# EAGLE schematic Power_Cape (EAGLE 7.7.0)
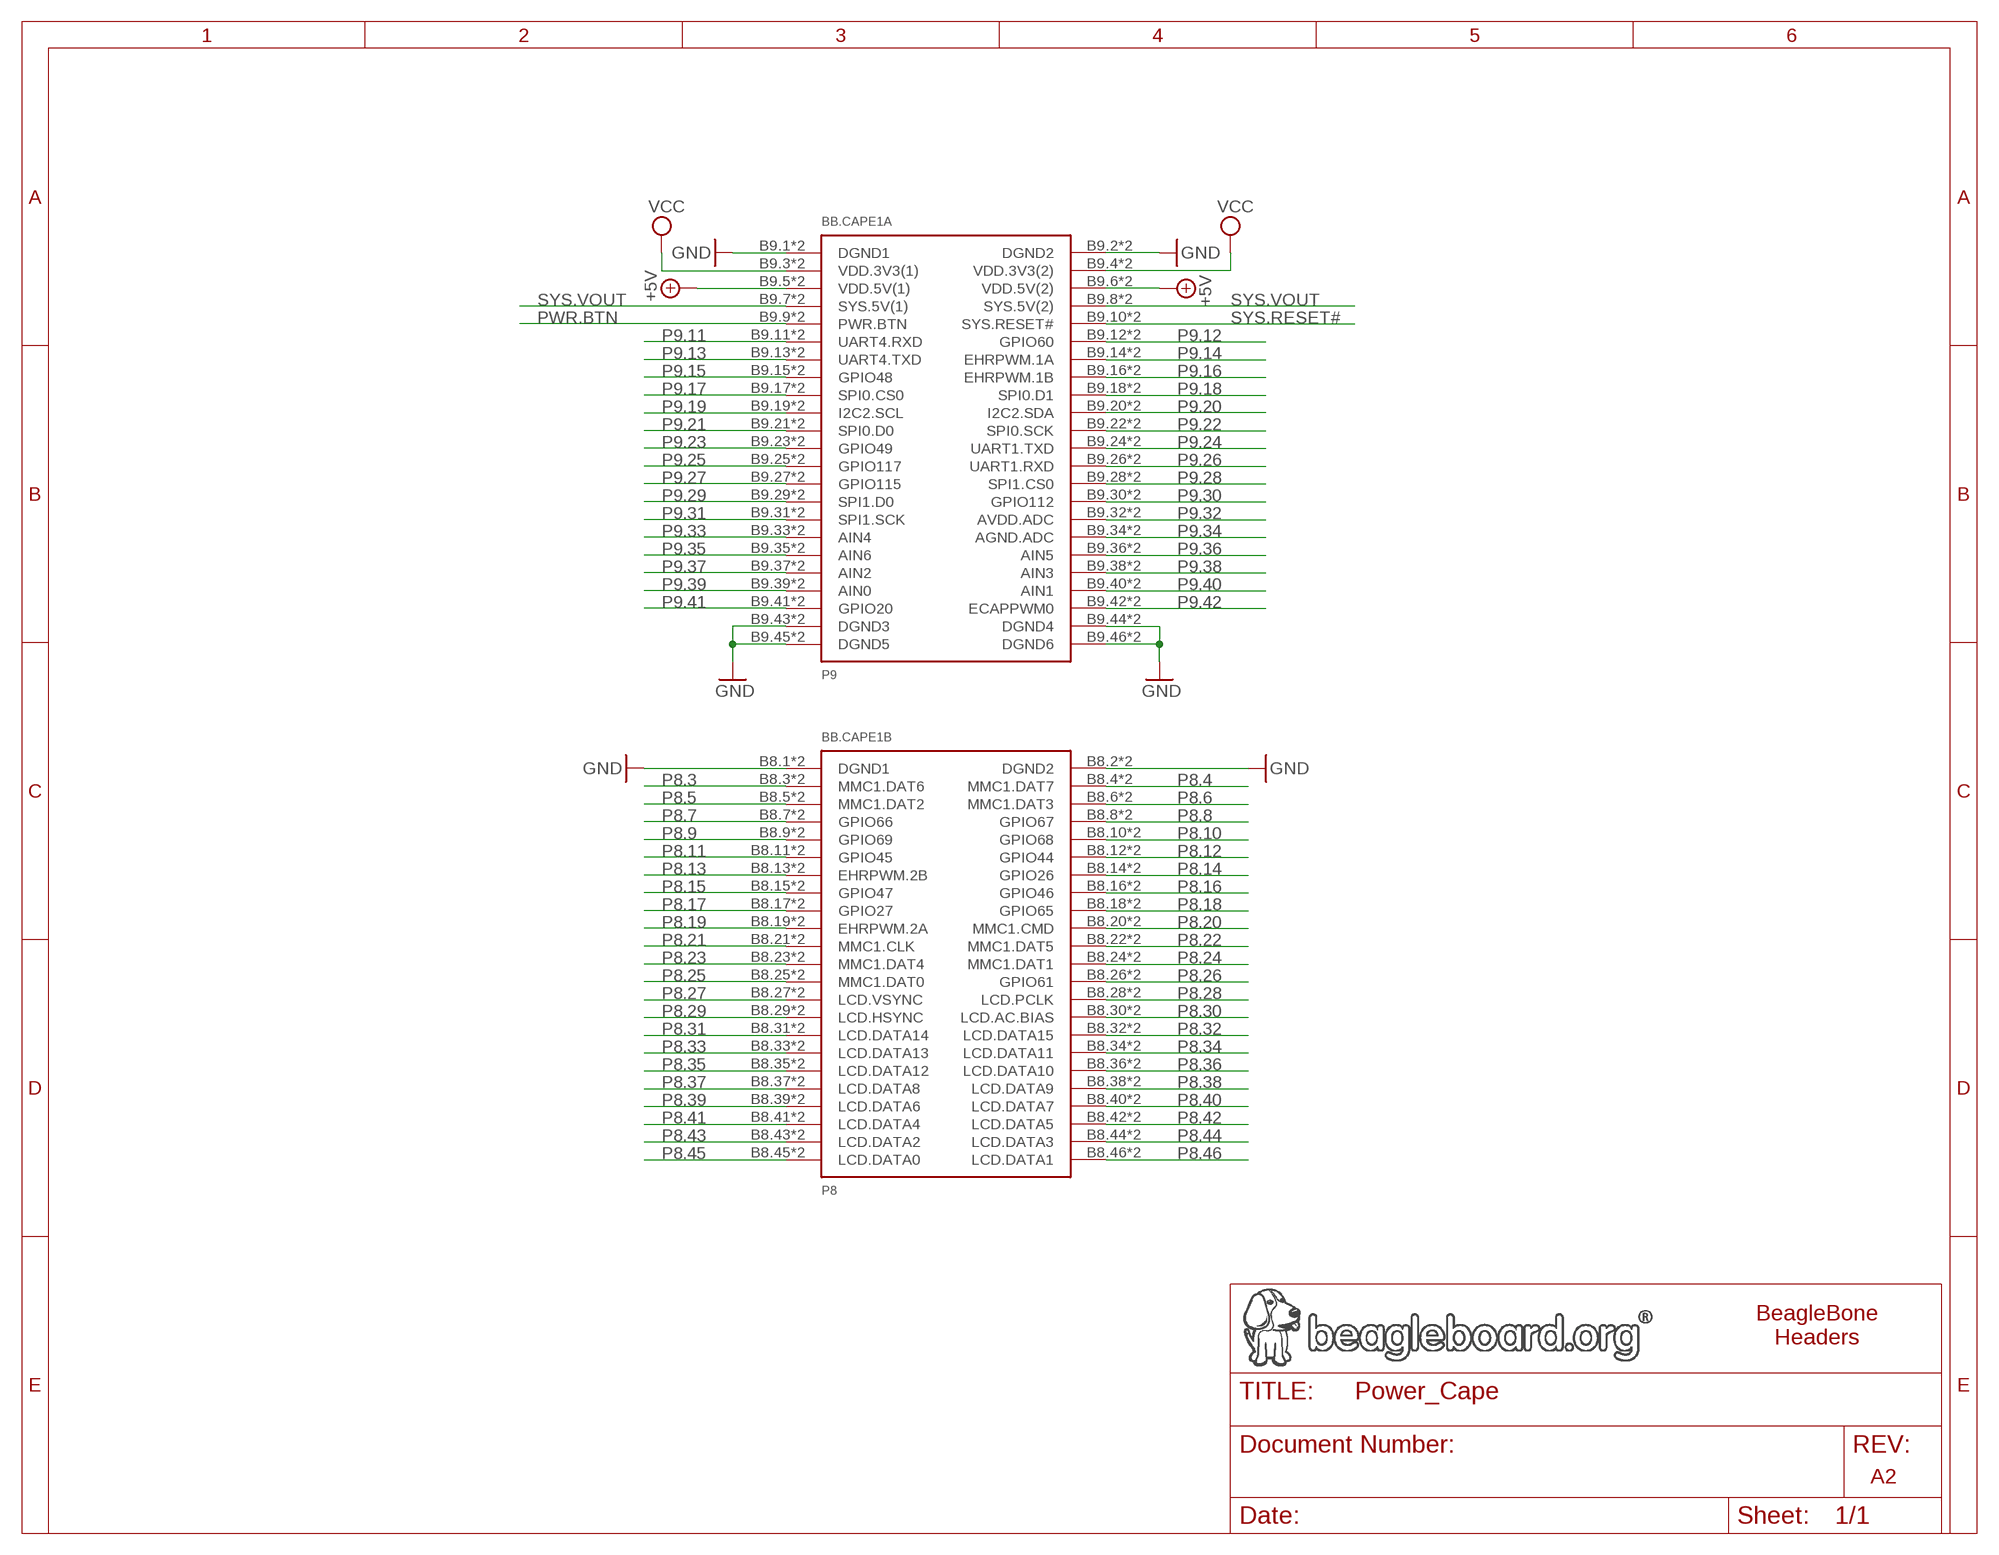
[diagram p0: schematic, sheet 1, part 1 of 2]
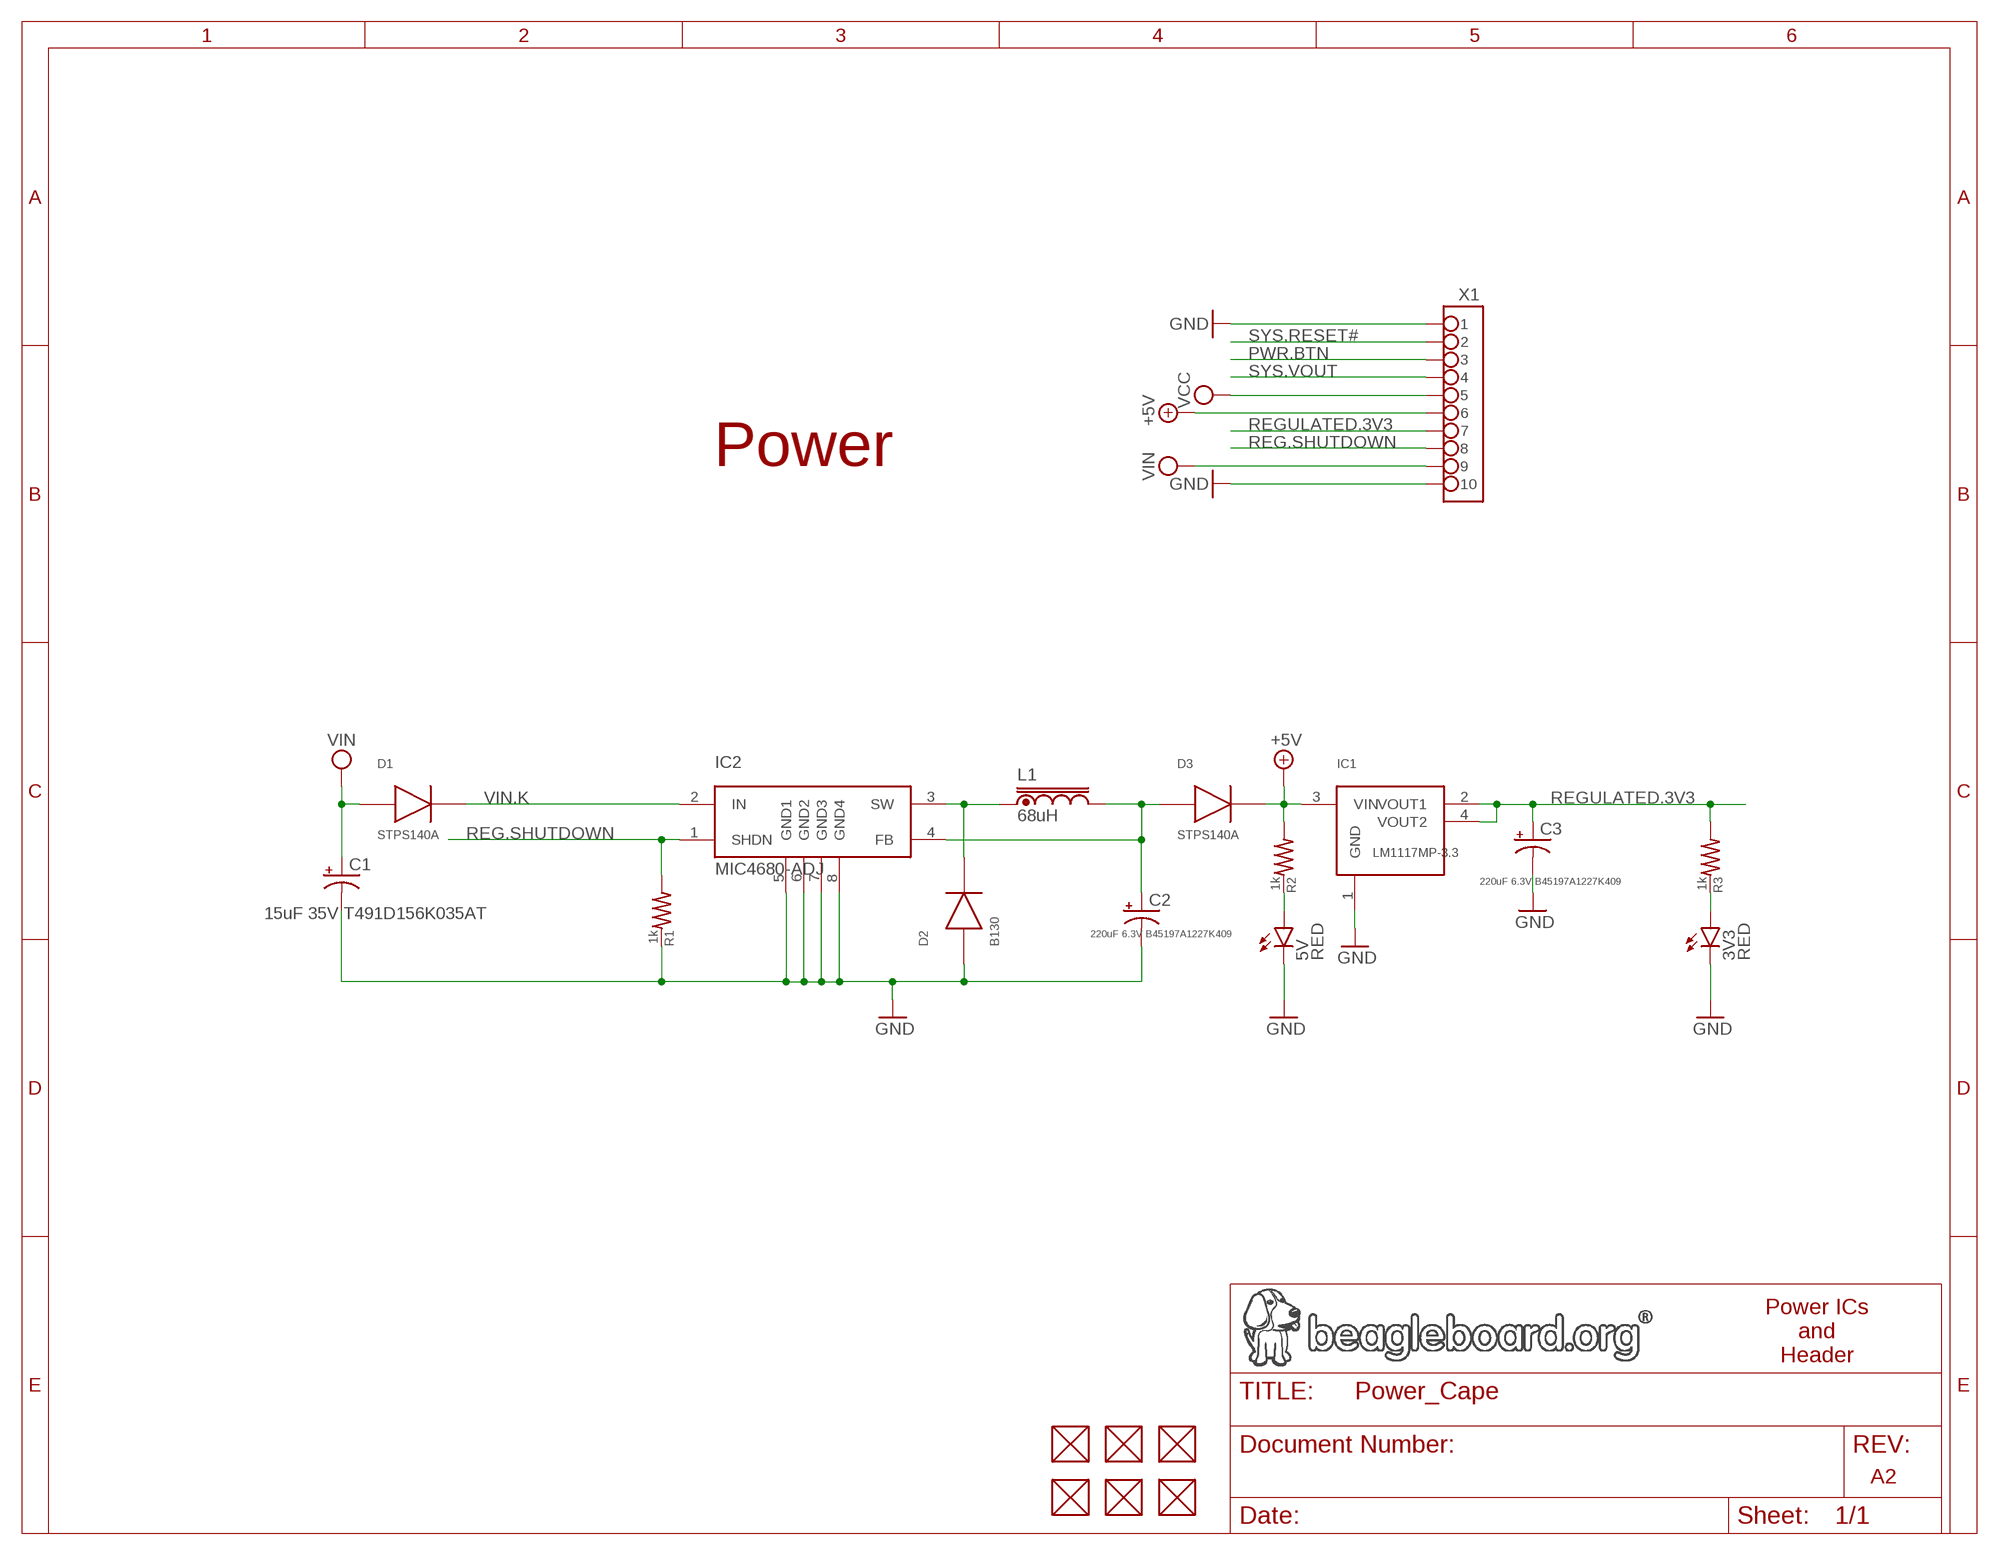
[diagram p1: schematic, sheet 1, part 2 of 2]

## Parts
3V3  RED  LED-(INCH)-0805  [0805-LED]
5V  RED  LED-(INCH)-0805  [0805-LED]
BB.CAPE1  BEAGLEBONE.CAPE.TOP/BOTTOM-PADS  [BEAGLEBONE.CAPE.TOP/BOTTOM-PADS]
C1  15uF 35V T491D156K035AT  CPOL-USD/7343-31W  [D/7343-31W]
C2  220uF 6.3V B45197A1227K409  CPOL-USD/7343-31W  [D/7343-31W]
C3  220uF 6.3V B45197A1227K409  CPOL-USD/7343-31W  [D/7343-31W]
D1  STPS140A  DIODE_SMA  [DIODE_SMA]
D2  B130  DIODE_SMA  [DIODE_SMA]
D3  STPS140A  DIODE_SMA  [DIODE_SMA]
FUD1  FIDUCIAL  [FIDUCIAL_40MIL]
FUD2  FIDUCIAL  [FIDUCIAL_40MIL]
FUD3  FIDUCIAL  [FIDUCIAL_40MIL]
FUD4  FIDUCIAL  [FIDUCIAL_40MIL]
FUD5  FIDUCIAL  [FIDUCIAL_40MIL]
FUD6  FIDUCIAL  [FIDUCIAL_40MIL]
IC1  LM1117MP-3.3  LM1117  [SOT223]
IC2  MIC4680-ADJ  MIC4680  [SO8]
L1  68uH  UP2B-XXX  [UP2B-(UNI-PAC)]
R1  1k  RESISTOR-(INCH)-0402  [0402]
R2  1k  RESISTOR-(INCH)-0402  [0402]
R3  1k  RESISTOR-(INCH)-0402  [0402]
X1  TB-10TERM-150MIL.PITCH  [TERMINAL.BLOCK-10TERM-150MIL.PITCH]

## Nets
5VOUT.A: D2.K IC2.3(SW) L1.1
5VOUT.B: C2.+ D3.A IC2.4(FB) L1.2
+5V [power]: BB.CAPE1.B9.5(A:VDD.5V(1)) BB.CAPE1.B9.6(A:VDD.5V(2)) BB.CAPE1.T9.5(A:VDD.5V(1)) BB.CAPE1.T9.6(A:VDD.5V(2)) D3.K IC1.3(VIN) R2.1 X1.6
GND: 3V3.K 5V.K BB.CAPE1.B8.1(B:DGND1) BB.CAPE1.B8.2(B:DGND2) BB.CAPE1.B9.1(A:DGND1) BB.CAPE1.B9.2(A:DGND2) BB.CAPE1.B9.43(A:DGND3) BB.CAPE1.B9.44(A:DGND4) BB.CAPE1.B9.45(A:DGND5) BB.CAPE1.B9.46(A:DGND6) BB.CAPE1.T8.1(B:DGND1) BB.CAPE1.T8.2(B:DGND2) BB.CAPE1.T9.1(A:DGND1) BB.CAPE1.T9.2(A:DGND2) BB.CAPE1.T9.43(A:DGND3) BB.CAPE1.T9.44(A:DGND4) BB.CAPE1.T9.45(A:DGND5) BB.CAPE1.T9.46(A:DGND6) C1.- C2.- C3.- D2.A IC1.1(GND) IC2.5(GND1) IC2.6(GND2) IC2.7(GND3) IC2.8(GND4) R1.2 X1.1 X1.10
N$3: 5V.A R2.2
N$36: 3V3.A R3.2
P8.3: BB.CAPE1.B8.3(B:MMC1.DAT6) BB.CAPE1.T8.3(B:MMC1.DAT6)
P8.4: BB.CAPE1.B8.4(B:MMC1.DAT7) BB.CAPE1.T8.4(B:MMC1.DAT7)
P8.5: BB.CAPE1.B8.5(B:MMC1.DAT2) BB.CAPE1.T8.5(B:MMC1.DAT2)
P8.6: BB.CAPE1.B8.6(B:MMC1.DAT3) BB.CAPE1.T8.6(B:MMC1.DAT3)
P8.7: BB.CAPE1.B8.7(B:GPIO66) BB.CAPE1.T8.7(B:GPIO66)
P8.8: BB.CAPE1.B8.8(B:GPIO67) BB.CAPE1.T8.8(B:GPIO67)
P8.9: BB.CAPE1.B8.9(B:GPIO69) BB.CAPE1.T8.9(B:GPIO69)
P8.10: BB.CAPE1.B8.10(B:GPIO68) BB.CAPE1.T8.10(B:GPIO68)
P8.11: BB.CAPE1.B8.11(B:GPIO45) BB.CAPE1.T8.11(B:GPIO45)
P8.12: BB.CAPE1.B8.12(B:GPIO44) BB.CAPE1.T8.12(B:GPIO44)
P8.13: BB.CAPE1.B8.13(B:EHRPWM.2B) BB.CAPE1.T8.13(B:EHRPWM.2B)
P8.14: BB.CAPE1.B8.14(B:GPIO26) BB.CAPE1.T8.14(B:GPIO26)
P8.15: BB.CAPE1.B8.15(B:GPIO47) BB.CAPE1.T8.15(B:GPIO47)
P8.16: BB.CAPE1.B8.16(B:GPIO46) BB.CAPE1.T8.16(B:GPIO46)
P8.17: BB.CAPE1.B8.17(B:GPIO27) BB.CAPE1.T8.17(B:GPIO27)
P8.18: BB.CAPE1.B8.18(B:GPIO65) BB.CAPE1.T8.18(B:GPIO65)
P8.19: BB.CAPE1.B8.19(B:EHRPWM.2A) BB.CAPE1.T8.19(B:EHRPWM.2A)
P8.20: BB.CAPE1.B8.20(B:MMC1.CMD) BB.CAPE1.T8.20(B:MMC1.CMD)
P8.21: BB.CAPE1.B8.21(B:MMC1.CLK) BB.CAPE1.T8.21(B:MMC1.CLK)
P8.22: BB.CAPE1.B8.22(B:MMC1.DAT5) BB.CAPE1.T8.22(B:MMC1.DAT5)
P8.23: BB.CAPE1.B8.23(B:MMC1.DAT4) BB.CAPE1.T8.23(B:MMC1.DAT4)
P8.24: BB.CAPE1.B8.24(B:MMC1.DAT1) BB.CAPE1.T8.24(B:MMC1.DAT1)
P8.25: BB.CAPE1.B8.25(B:MMC1.DAT0) BB.CAPE1.T8.25(B:MMC1.DAT0)
P8.26: BB.CAPE1.B8.26(B:GPIO61) BB.CAPE1.T8.26(B:GPIO61)
P8.27: BB.CAPE1.B8.27(B:LCD.VSYNC) BB.CAPE1.T8.27(B:LCD.VSYNC)
P8.28: BB.CAPE1.B8.28(B:LCD.PCLK) BB.CAPE1.T8.28(B:LCD.PCLK)
P8.29: BB.CAPE1.B8.29(B:LCD.HSYNC) BB.CAPE1.T8.29(B:LCD.HSYNC)
P8.30: BB.CAPE1.B8.30(B:LCD.AC.BIAS) BB.CAPE1.T8.30(B:LCD.AC.BIAS)
P8.31: BB.CAPE1.B8.31(B:LCD.DATA14) BB.CAPE1.T8.31(B:LCD.DATA14)
P8.32: BB.CAPE1.B8.32(B:LCD.DATA15) BB.CAPE1.T8.32(B:LCD.DATA15)
P8.33: BB.CAPE1.B8.33(B:LCD.DATA13) BB.CAPE1.T8.33(B:LCD.DATA13)
P8.34: BB.CAPE1.B8.34(B:LCD.DATA11) BB.CAPE1.T8.34(B:LCD.DATA11)
P8.35: BB.CAPE1.B8.35(B:LCD.DATA12) BB.CAPE1.T8.35(B:LCD.DATA12)
P8.36: BB.CAPE1.B8.36(B:LCD.DATA10) BB.CAPE1.T8.36(B:LCD.DATA10)
P8.37: BB.CAPE1.B8.37(B:LCD.DATA8) BB.CAPE1.T8.37(B:LCD.DATA8)
P8.38: BB.CAPE1.B8.38(B:LCD.DATA9) BB.CAPE1.T8.38(B:LCD.DATA9)
P8.39: BB.CAPE1.B8.39(B:LCD.DATA6) BB.CAPE1.T8.39(B:LCD.DATA6)
P8.40: BB.CAPE1.B8.40(B:LCD.DATA7) BB.CAPE1.T8.40(B:LCD.DATA7)
P8.41: BB.CAPE1.B8.41(B:LCD.DATA4) BB.CAPE1.T8.41(B:LCD.DATA4)
P8.42: BB.CAPE1.B8.42(B:LCD.DATA5) BB.CAPE1.T8.42(B:LCD.DATA5)
P8.43: BB.CAPE1.B8.43(B:LCD.DATA2) BB.CAPE1.T8.43(B:LCD.DATA2)
P8.44: BB.CAPE1.B8.44(B:LCD.DATA3) BB.CAPE1.T8.44(B:LCD.DATA3)
P8.45: BB.CAPE1.B8.45(B:LCD.DATA0) BB.CAPE1.T8.45(B:LCD.DATA0)
P8.46: BB.CAPE1.B8.46(B:LCD.DATA1) BB.CAPE1.T8.46(B:LCD.DATA1)
P9.11: BB.CAPE1.B9.11(A:UART4.RXD) BB.CAPE1.T9.11(A:UART4.RXD)
P9.12: BB.CAPE1.B9.12(A:GPIO60) BB.CAPE1.T9.12(A:GPIO60)
P9.13: BB.CAPE1.B9.13(A:UART4.TXD) BB.CAPE1.T9.13(A:UART4.TXD)
P9.14: BB.CAPE1.B9.14(A:EHRPWM.1A) BB.CAPE1.T9.14(A:EHRPWM.1A)
P9.15: BB.CAPE1.B9.15(A:GPIO48) BB.CAPE1.T9.15(A:GPIO48)
P9.16: BB.CAPE1.B9.16(A:EHRPWM.1B) BB.CAPE1.T9.16(A:EHRPWM.1B)
P9.17: BB.CAPE1.B9.17(A:SPI0.CS0) BB.CAPE1.T9.17(A:SPI0.CS0)
P9.18: BB.CAPE1.B9.18(A:SPI0.D1) BB.CAPE1.T9.18(A:SPI0.D1)
P9.19: BB.CAPE1.B9.19(A:I2C2.SCL) BB.CAPE1.T9.19(A:I2C2.SCL)
P9.20: BB.CAPE1.B9.20(A:I2C2.SDA) BB.CAPE1.T9.20(A:I2C2.SDA)
P9.21: BB.CAPE1.B9.21(A:SPI0.D0) BB.CAPE1.T9.21(A:SPI0.D0)
P9.22: BB.CAPE1.B9.22(A:SPI0.SCK) BB.CAPE1.T9.22(A:SPI0.SCK)
P9.23: BB.CAPE1.B9.23(A:GPIO49) BB.CAPE1.T9.23(A:GPIO49)
P9.24: BB.CAPE1.B9.24(A:UART1.TXD) BB.CAPE1.T9.24(A:UART1.TXD)
P9.25: BB.CAPE1.B9.25(A:GPIO117) BB.CAPE1.T9.25(A:GPIO117)
P9.26: BB.CAPE1.B9.26(A:UART1.RXD) BB.CAPE1.T9.26(A:UART1.RXD)
P9.27: BB.CAPE1.B9.27(A:GPIO115) BB.CAPE1.T9.27(A:GPIO115)
P9.28: BB.CAPE1.B9.28(A:SPI1.CS0) BB.CAPE1.T9.28(A:SPI1.CS0)
P9.29: BB.CAPE1.B9.29(A:SPI1.D0) BB.CAPE1.T9.29(A:SPI1.D0)
P9.30: BB.CAPE1.B9.30(A:GPIO112) BB.CAPE1.T9.30(A:GPIO112)
P9.31: BB.CAPE1.B9.31(A:SPI1.SCK) BB.CAPE1.T9.31(A:SPI1.SCK)
P9.32: BB.CAPE1.B9.32(A:AVDD.ADC) BB.CAPE1.T9.32(A:AVDD.ADC)
P9.33: BB.CAPE1.B9.33(A:AIN4) BB.CAPE1.T9.33(A:AIN4)
P9.34: BB.CAPE1.B9.34(A:AGND.ADC) BB.CAPE1.T9.34(A:AGND.ADC)
P9.35: BB.CAPE1.B9.35(A:AIN6) BB.CAPE1.T9.35(A:AIN6)
P9.36: BB.CAPE1.B9.36(A:AIN5) BB.CAPE1.T9.36(A:AIN5)
P9.37: BB.CAPE1.B9.37(A:AIN2) BB.CAPE1.T9.37(A:AIN2)
P9.38: BB.CAPE1.B9.38(A:AIN3) BB.CAPE1.T9.38(A:AIN3)
P9.39: BB.CAPE1.B9.39(A:AIN0) BB.CAPE1.T9.39(A:AIN0)
P9.40: BB.CAPE1.B9.40(A:AIN1) BB.CAPE1.T9.40(A:AIN1)
P9.41: BB.CAPE1.B9.41(A:GPIO20) BB.CAPE1.T9.41(A:GPIO20)
P9.42: BB.CAPE1.B9.42(A:ECAPPWM0) BB.CAPE1.T9.42(A:ECAPPWM0)
PWR.BTN: BB.CAPE1.B9.9(A:PWR.BTN) BB.CAPE1.T9.9(A:PWR.BTN) X1.3
REG.SHUTDOWN: IC2.1(SHDN) R1.1 X1.8
REGULATED.3V3: C3.+ IC1.2(VOUT1) IC1.4(VOUT2) R3.1 X1.7
SYS.RESET#: BB.CAPE1.B9.10(A:SYS.RESET#) BB.CAPE1.T9.10(A:SYS.RESET#) X1.2
SYS.VOUT: BB.CAPE1.B9.7(A:SYS.5V(1)) BB.CAPE1.B9.8(A:SYS.5V(2)) BB.CAPE1.T9.7(A:SYS.5V(1)) BB.CAPE1.T9.8(A:SYS.5V(2)) X1.4
VCC: BB.CAPE1.B9.3(A:VDD.3V3(1)) BB.CAPE1.B9.4(A:VDD.3V3(2)) BB.CAPE1.T9.3(A:VDD.3V3(1)) BB.CAPE1.T9.4(A:VDD.3V3(2)) X1.5
VIN: C1.+ D1.A X1.9
VIN.K: D1.K IC2.2(IN)
Unconnected: FUD1.P$1 FUD2.P$1 FUD3.P$1 FUD4.P$1 FUD5.P$1 FUD6.P$1

## Notes on the sheet
- Power
- BeagleBone
  Headers
- Power ICs
  and
  Header
- A2 | A2

## Library data of the parts
3V3 5V = GHI-BasicComponents:LED-(INCH)-: Basic SMD LEDs
BB.CAPE1 = GHI-Solutions:BEAGLEBONE.CAPE
C1-C3 = rcl:CPOL-US: POLARIZED CAPACITOR, American symbol
D1-D3 = GHI:DIODE_SMA
FUD1-FUD6 = GHI:FIDUCIAL
IC1 = GHI:LM1117
IC2 = GHI:MIC4680
L1 = GHI-BasicComponents:UP2B-XXX: UNI-PAC Drum core power inductors
R1-R3 = GHI-BasicComponents:RESISTOR-(INCH)-: Basic SMD Resistors
X1 = GHI-Connectors:TB-10TERM-150MIL.PITCH